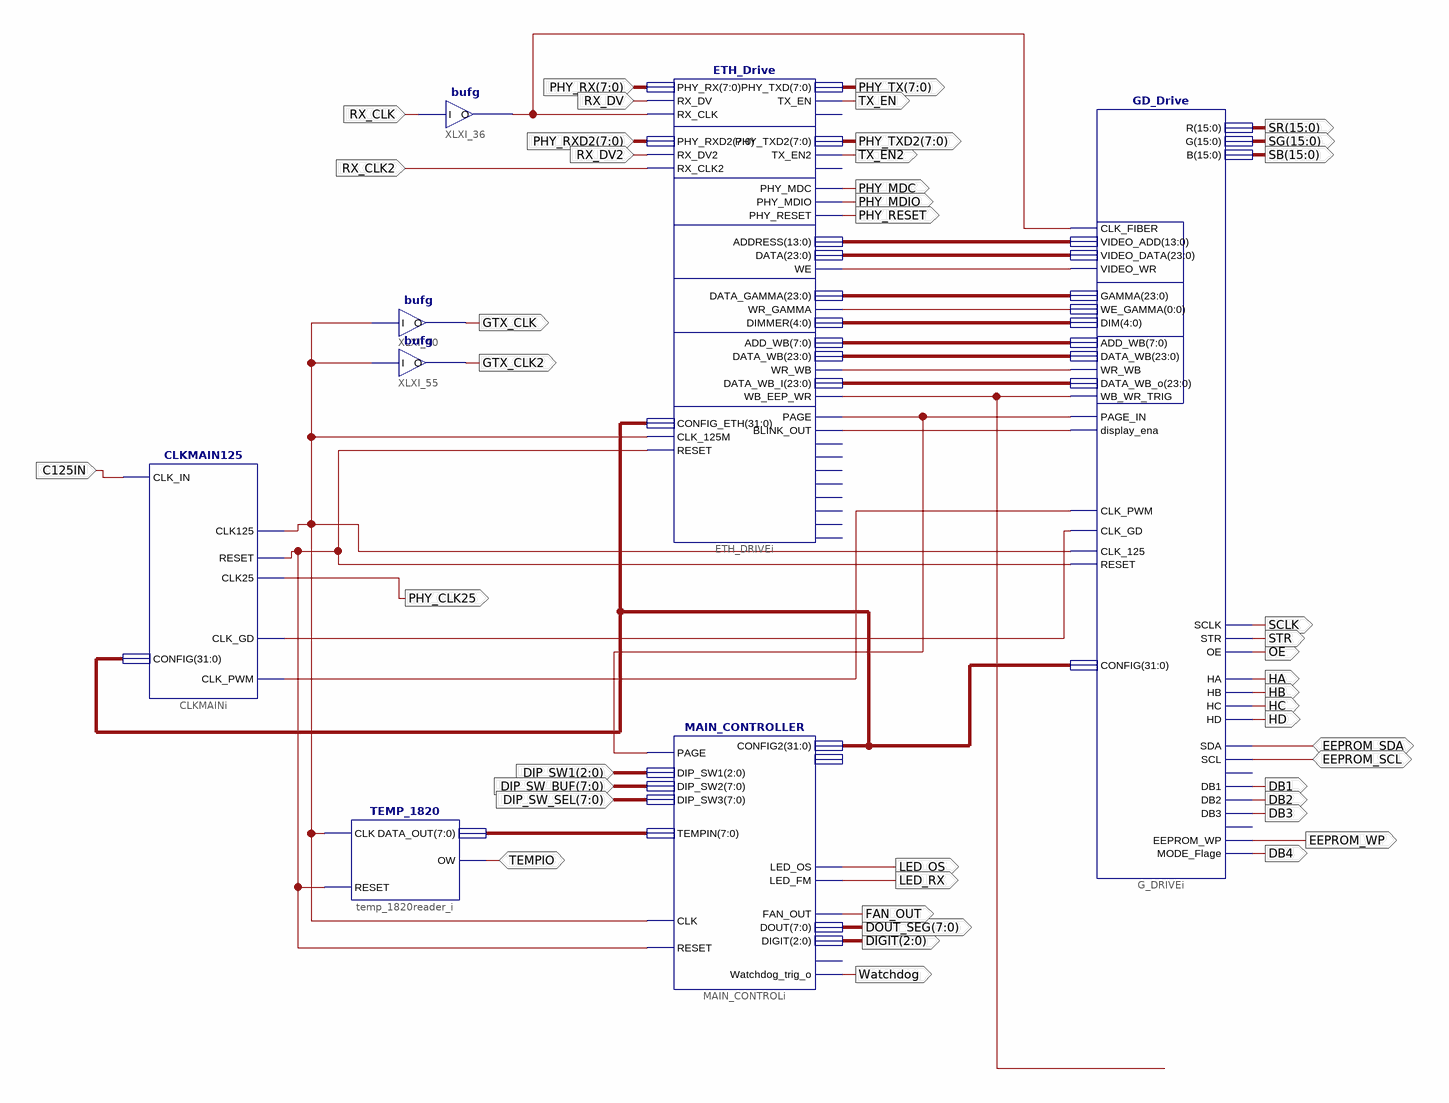
[diagram p0: schematic sheet 1]
// Xilinx ISE schematic GD_N_C_RP.sch (spartan6) as structural Verilog: 8 symbols, 44 ports
module GD_N_C_RP (
  input  C125IN,
  input  [2:0] DIP_SW1,
  input  [7:0] DIP_SW_BUF,
  input  [7:0] DIP_SW_SEL,
  input  [7:0] PHY_RX,
  input  RX_DV,
  input  RX_CLK,
  input  RX_CLK2,
  input  [7:0] PHY_RXD2,
  input  RX_DV2,
  inout  TEMPIO,
  inout  EEPROM_SDA,
  inout  EEPROM_SCL,
  output PHY_CLK25,
  output FAN_OUT,
  output [7:0] DOUT_SEG,
  output [2:0] DIGIT,
  output LED_OS,
  output LED_RX,
  output [7:0] PHY_TX,
  output PHY_MDC,
  output PHY_MDIO,
  output PHY_RESET,
  output TX_EN,
  output TX_EN2,
  output [7:0] PHY_TXD2,
  output OE,
  output SCLK,
  output STR,
  output HA,
  output HB,
  output HC,
  output Watchdog,
  output EEPROM_WP,
  output [15:0] SR,
  output [15:0] SG,
  output [15:0] SB,
  output GTX_CLK,
  output GTX_CLK2,
  output DB1,
  output DB2,
  output DB3,
  output HD,
  output DB4
);

  wire XLXN_649, XLXN_675, XLXN_695, XLXN_709, XLXN_867, XLXN_882, XLXN_962, XLXN_966, XLXN_968, XLXN_969;
  wire [0:0] XLXN_833;
  wire [4:0] XLXN_832;
  wire [7:0] XLXN_467, XLXN_865;
  wire [13:0] XLXN_673;
  wire [23:0] XLXN_674, XLXN_679, XLXN_866, XLXN_868;
  wire [31:0] XLXN_967;

  CLKMAIN125 CLKMAINi (
    .CLK_IN(C125IN), .CONFIG(XLXN_967), .RESET(XLXN_649), .CLK_GD(XLXN_966), .CLK25(PHY_CLK25),
    .CLK125(XLXN_962), .CLK_PWM(XLXN_968));
  MAIN_CONTROLLER MAIN_CONTROLi (
    .CLK(XLXN_962), .RESET(XLXN_649), .PAGE(XLXN_695), .DIP_SW1(DIP_SW1), .DIP_SW2(DIP_SW_BUF),
    .DIP_SW3(DIP_SW_SEL), .TEMPIN(XLXN_467), .LED_OS(LED_OS), .LED_FM(LED_RX), .FAN_OUT(FAN_OUT),
    .Watchdog_trig_o(Watchdog), .CONFIG2(XLXN_967), .DOUT(DOUT_SEG), .DIGIT(DIGIT));  // open: ONOFF_OUT, CONFIG1
  TEMP_1820 temp_1820reader_i (.CLK(XLXN_962), .RESET(XLXN_649), .OW(TEMPIO), .DATA_OUT(XLXN_467));
  bufg XLXI_36 (.I(RX_CLK), .O(XLXN_709));
  ETH_Drive ETH_DRIVEi (
    .CLK_125M(XLXN_962), .RX_CLK(XLXN_709), .RX_DV(RX_DV), .PHY_RX(PHY_RX), .CONFIG_ETH(XLXN_967),
    .DATA_WB_I(XLXN_868), .RX_DV2(RX_DV2), .PHY_RXD2(PHY_RXD2), .RX_CLK2(RX_CLK2), .RESET(XLXN_649),
    .DIMMER(XLXN_832), .PAGE(XLXN_695), .WB_EEP_WR(XLXN_882), .WR_GAMMA(XLXN_833[0]), .DATA_GAMMA(XLXN_679),
    .DATA_WB(XLXN_866), .ADD_WB(XLXN_865), .WR_WB(XLXN_867), .PHY_RESET(PHY_RESET), .PHY_TXD2(PHY_TXD2),
    .TX_EN2(TX_EN2), .PHY_MDIO(PHY_MDIO), .PHY_MDC(PHY_MDC), .ADDRESS(XLXN_673), .DATA(XLXN_674),
    .WE(XLXN_675), .PHY_TXD(PHY_TX), .TX_EN(TX_EN), .BLINK_OUT(XLXN_969));  // open: DB5, DB6, DB7, DB8, GTX_CLK2, DB2, DB_1, GTX_CLK, DB3, DB4
  bufg XLXI_40 (.I(XLXN_962), .O(GTX_CLK));
  bufg XLXI_55 (.I(XLXN_962), .O(GTX_CLK2));
  GD_Drive G_DRIVEi (
    .RESET(XLXN_649), .CLK_FIBER(XLXN_709), .VIDEO_ADD(XLXN_673), .VIDEO_DATA(XLXN_674), .VIDEO_WR(XLXN_675),
    .WE_GAMMA(XLXN_833[0]), .GAMMA(XLXN_679), .CLK_GD(XLXN_966), .DIM(XLXN_832), .PAGE_IN(XLXN_695),
    .CLK_125(XLXN_962), .ADD_WB(XLXN_865), .DATA_WB(XLXN_866), .WR_WB(XLXN_867), .CONFIG(XLXN_967),
    .WB_WR_TRIG(XLXN_882), .CLK_PWM(XLXN_968), .display_ena(XLXN_969), .SDA(EEPROM_SDA), .SCL(EEPROM_SCL),
    .SCLK(SCLK), .STR(STR), .OE(OE), .DATA_WB_o(XLXN_868), .HA(HA), .HB(HB), .HC(HC), .HD(HD), .DB1(DB1),
    .DB2(DB2), .DB3(DB3), .EEPROM_WP(EEPROM_WP), .R(SR), .G(SG), .B(SB), .MODE_Flage(DB4));  // open: DB4, i2c_ack_error
endmodule
